# Altium schematic sheet USB-TTL.SchDoc
size A; SheetNumber: 1; SheetTotal: 1
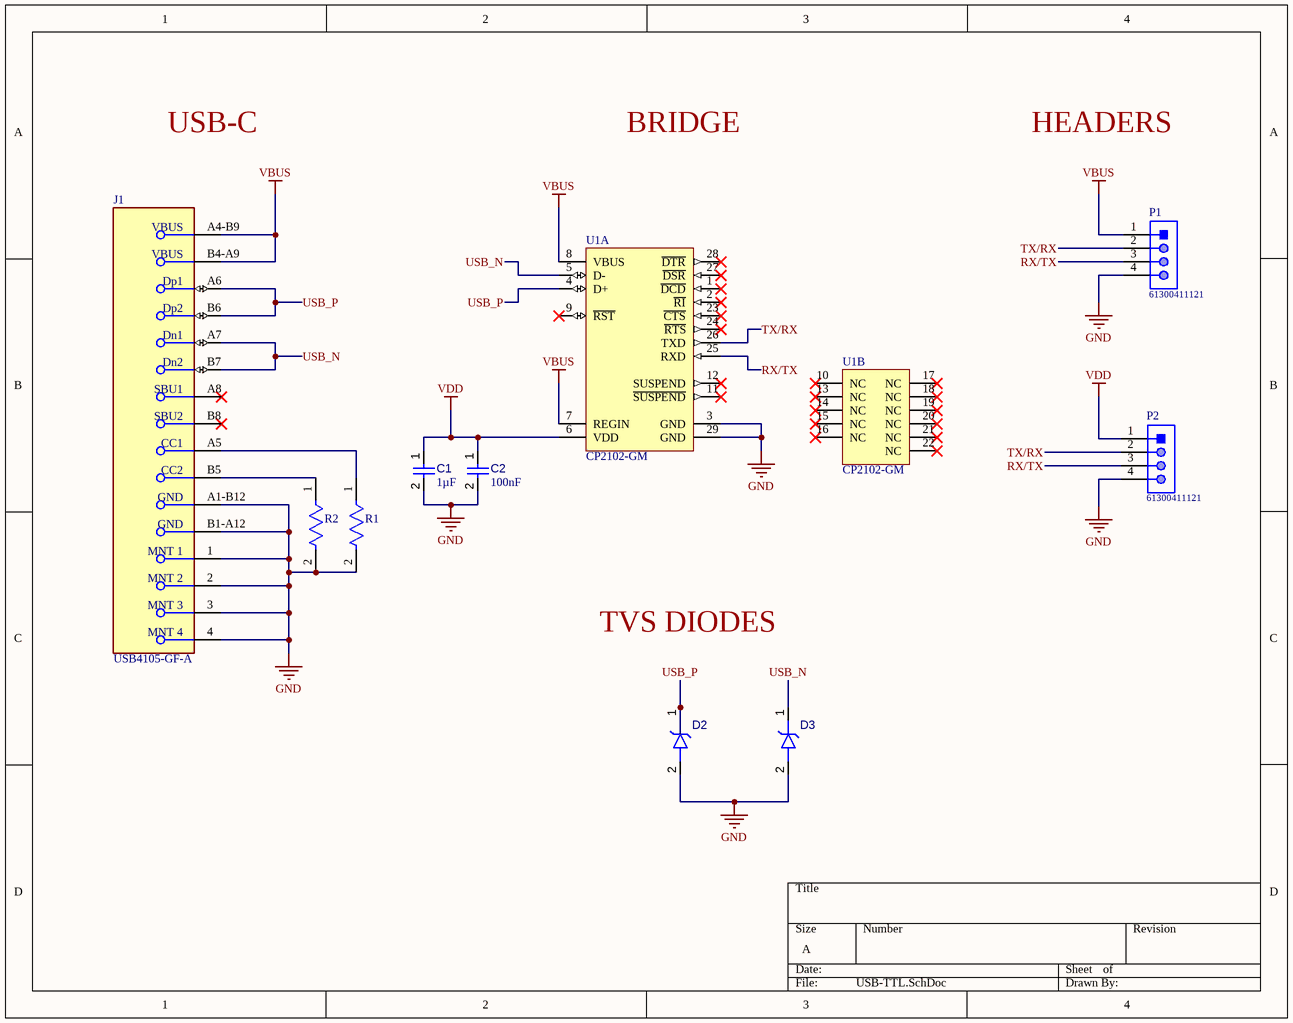
[diagram p0: USB-TTL.SchDoc]

## Parts
C1  value 1µF  [CAPC1608X94X35NL15T15]  (hidden comment: Capacitor 1 uF +/- 10% 16 V 0603)
C2  value 100nF  [CAPC1608X90X40NL10T20]  (hidden comment: Capacitor 100 nF +/-10% 50 V 0603)
D2  ESDA25P35-1U1M  [STM-QFN1610]  (value not drawn)
D3  ESDA25P35-1U1M  [STM-QFN1610]  (value not drawn)
J1  USB4105-GF-A  [FP-USB4105-GF-A-MFG]
P1  61300411121  [61300411121]
P2  61300411121  [61300411121]
R1  ERA-3AEB512V  [FP-ERA3A-MFG]  (value not drawn)
R2  ERA-3AEB512V  [FP-ERA3A-MFG]  (value not drawn)
U1  CP2102-GM  [SLAB-QFN-28-3125x3125TP_L]  (parts A,B of 2)

## Nets
GND: C1.2 C2.2 D2.2(A) D3.2(A) J1.1(MNT_1) J1.2(MNT_2) J1.3(MNT_3) J1.4(MNT_4) J1.A1-B12(GND) J1.B1-A12(GND) P1.4 P2.4 R1.2 R2.2 U1.3(GND) U1.29(GND)
VBUS: J1.A4-B9(VBUS) J1.B4-A9(VBUS) P1.1 U1.7(REGIN) U1.8(VBUS)
VDD: C1.1 C2.1 P2.1 U1.6(VDD)
RX/TX: P1.3 P2.3 U1.25(RXD)
TX/RX: P1.2 P2.2 U1.26(TXD)
USB_N: D3.1(A) J1.A7(Dn1) J1.B7(Dn2) U1.5(D-)
USB_P: D2.1(A) J1.A6(Dp1) J1.B6(Dp2) U1.4(D+)
NetJ1_A5: J1.A5(CC1) R1.1
NetJ1_B5: J1.B5(CC2) R2.1

Not connected (* = marked no-connect by the designer): J1 A8(SBU1)* B8(SBU2)*; U1 1(~{DCD})* 2(~{RI})* 9(~{RST})* 10(NC)* 11(~{SUSPEND})* 12(SUSPEND)* 13(NC)* 14(NC)* 15(NC)* 16(NC)* 17(NC)* 18(NC)* 19(NC)* 20(NC)* 21(NC)* 22(NC)* 23(~{CTS})* 24(~{RTS})* 27(~{DSR})* 28(~{DTR})*

## Notes on the sheet
- USB-C
- BRIDGE
- HEADERS
- TVS DIODES

## Library data of the parts
C1 = CMP-001-00003-6: Chip Capacitor, 1 uF, +/- 10%, 16 V, 0603 (1608 Metric); Voltage Rating: 16V; Capacitor Type: Ceramic; Max Operating Temperature: 125°C; Pins: 2; Tolerance: 10%; Min Operating Temperature: -55°C; RoHS Compliant: True; Mounting Technology: SM; Case/Package: 0603
C2 = CMP-001-00017-6: Chip Capacitor, 100 nF, +/- 10%, 50 V, 0603 (1608 Metric); Voltage Rating: 50V; Capacitor Type: Ceramic; Tolerance: 10%; Mounting Technology: SM; Max Operating Temperature: 125°C; RoHS Compliant: True; Pins: 2; Case/Package: 0603; Min Operating Temperature: -55°C
D2 D3 = CMP-004-00023-3: TVS DIODE 22V 41V 1610; Peak Inverse Voltage: 23.3V; Max Surge Current: 35A; Mounting Technology: SMT; Case/Package: QFN1610 (0603); RoHS Compliant: Yes; Pins: 2
J1 = CMP-002-00074-1: Conn USB 2.0 Type C RCP 24 POS 0.3mm/0.5mm Solder RA SMD 24 Terminal 1 Port T/R
P1 P2 = CMP-002-00072-1: CONN HEADER 4 POS 2.54
R1 R2 = CMP-009-00177-1: Res Thin Film 0603 5.1K Ohm 0.1% 1/10W ±25ppm/°C Molded SMD SMD Punched Carrier T/R
U1 = CMP-015-00008-1: USB to UART Bridge Controller UART/USB Interface Automotive 28-Pin QFN EP Tube; Max Supply Voltage: 3.6V; Min Supply Voltage: 3V; Pins: QFN